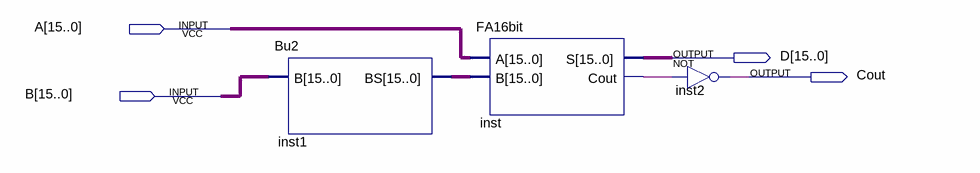
[diagram p0: schematic sheet]
// Quartus schematic Sub16bit.bdf as structural Verilog: 3 symbols, 4 pins
module Sub16bit (
  input  [15:0] A,
  input  [15:0] B,
  output [15:0] D,
  output Cout
);

  wire inst_cout;
  wire [15:0] inst1_bs;

  Bu2 inst1 (.B(B), .BS(inst1_bs));
  FA16bit inst (.A(A), .B(inst1_bs), .S(D), .Cout(inst_cout));
  not inst2 (Cout, inst_cout);
endmodule
